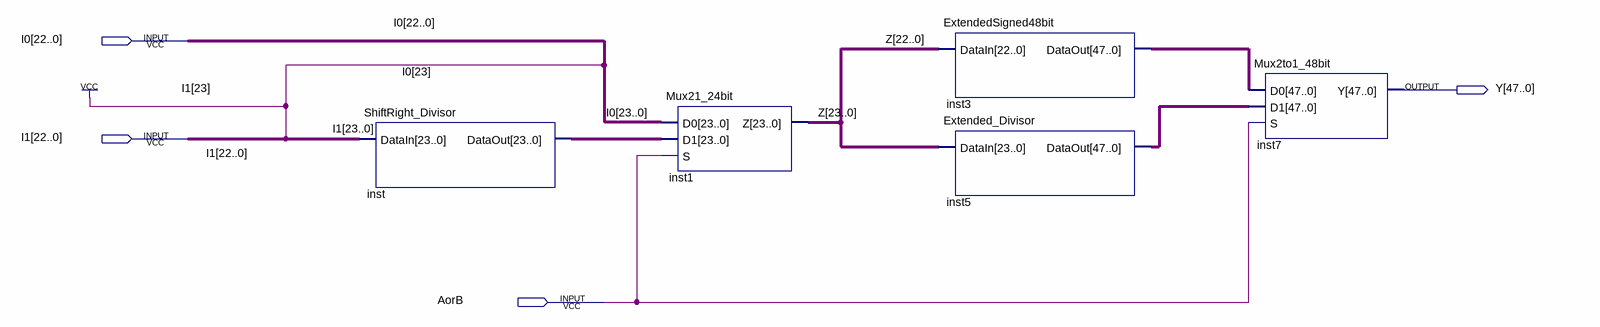
[diagram p0: schematic sheet]
// Quartus schematic MoRongBitChia.bdf as structural Verilog: 5 symbols, 4 pins
module MoRongBitChia (
  input  [22:0] I0,
  input  [22:0] I1,
  input  AorB,
  output [47:0] Y
);

  wire [23:0] inst_dataout, Z;
  wire [47:0] inst3_dataout, inst5_dataout;

  ShiftRight_Divisor inst (.DataIn({1'b1, I1}), .DataOut(inst_dataout));
  Mux21_24bit inst1 (.D0({1'b1, I0}), .D1(inst_dataout), .S(AorB), .Z(Z));
  ExtendedSigned48bit inst3 (.DataIn(Z[22:0]), .DataOut(inst3_dataout));
  Extended_Divisor inst5 (.DataIn(Z), .DataOut(inst5_dataout));
  Mux2to1_48bit inst7 (.D0(inst3_dataout), .D1(inst5_dataout), .S(AorB), .Y(Y));
endmodule
